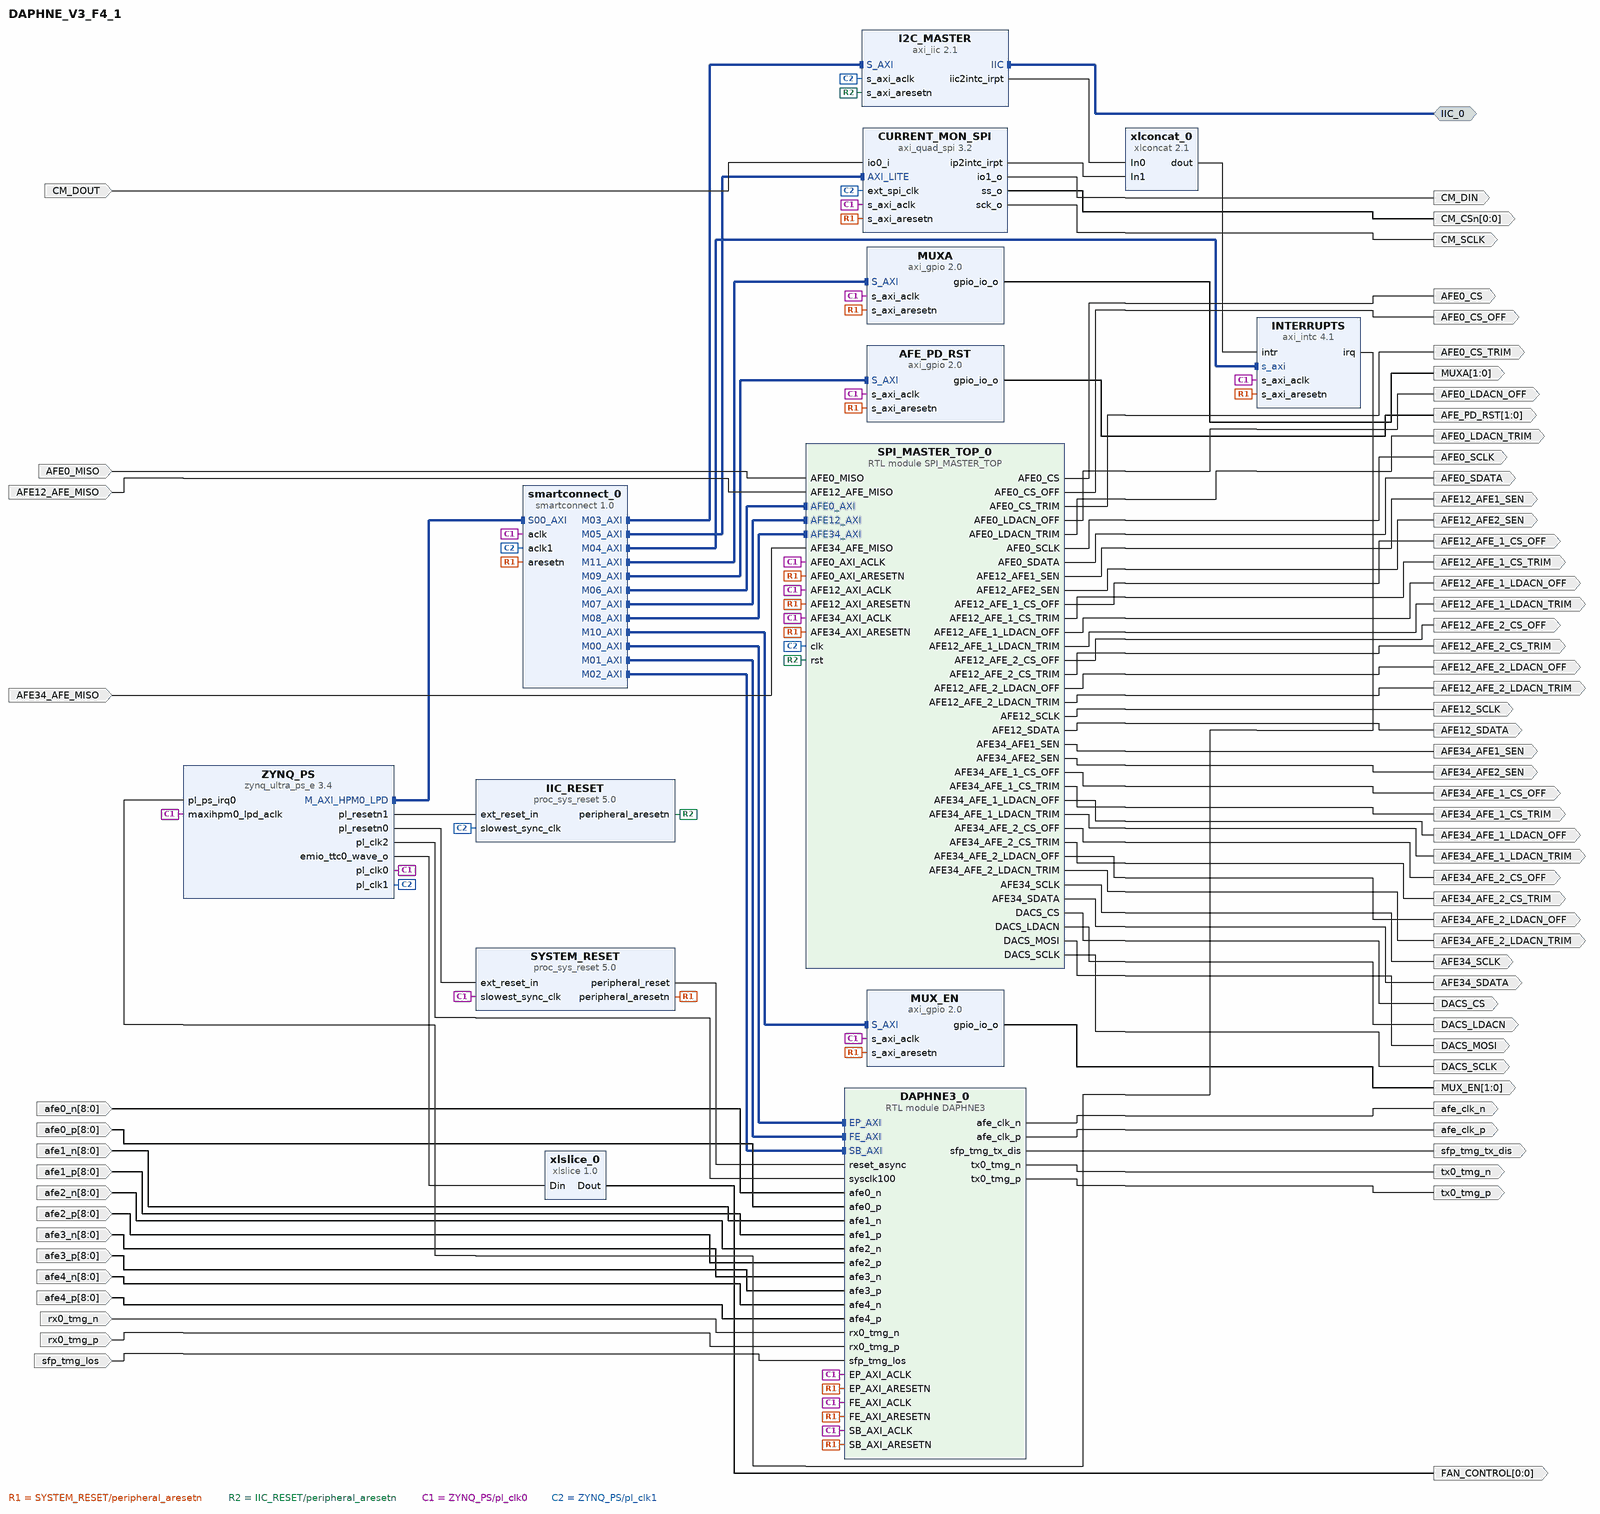
[diagram p0: block diagram of the top level]
# Vivado block design DAPHNE_V3_F4_1, xck26-sfvc784-2LV-c, Vivado 2022.2.2
create_bd_design DAPHNE_V3_F4_1

create_bd_intf_port -mode Master -vlnv xilinx.com:interface:iic_rtl:1.0 IIC_0
create_bd_port -dir O tx0_tmg_n
create_bd_port -dir I rx0_tmg_n
create_bd_port -dir I sfp_tmg_los
create_bd_port -dir I rx0_tmg_p
create_bd_port -dir O sfp_tmg_tx_dis
create_bd_port -dir O -type clk afe_clk_p
create_bd_port -dir I -from 8 -to 0 afe4_p
create_bd_port -dir I -from 8 -to 0 afe4_n
create_bd_port -dir I -from 8 -to 0 afe3_p
create_bd_port -dir I -from 8 -to 0 afe3_n
create_bd_port -dir I -from 8 -to 0 afe1_p
create_bd_port -dir I -from 8 -to 0 afe1_n
create_bd_port -dir I -from 8 -to 0 afe2_p
create_bd_port -dir I -from 8 -to 0 afe2_n
create_bd_port -dir I -from 8 -to 0 afe0_p
create_bd_port -dir I -from 8 -to 0 afe0_n
create_bd_port -dir O tx0_tmg_p
create_bd_port -dir O -type clk afe_clk_n
create_bd_port -dir I AFE0_MISO
create_bd_port -dir I AFE12_AFE_MISO
create_bd_port -dir I AFE34_AFE_MISO
create_bd_port -dir O AFE12_AFE_1_LDACN_OFF
create_bd_port -dir O AFE12_AFE_1_CS_OFF
create_bd_port -dir O AFE0_SCLK
create_bd_port -dir O AFE12_AFE1_SEN
create_bd_port -dir O AFE12_AFE_2_LDACN_OFF
create_bd_port -dir O AFE0_CS_TRIM
create_bd_port -dir O AFE0_CS
create_bd_port -dir O AFE0_SDATA
create_bd_port -dir O AFE34_AFE_1_LDACN_TRIM
create_bd_port -dir O AFE0_CS_OFF
create_bd_port -dir O AFE12_SDATA
create_bd_port -dir O AFE34_AFE_2_CS_OFF
create_bd_port -dir O AFE12_AFE_2_CS_OFF
create_bd_port -dir O AFE34_AFE2_SEN
create_bd_port -dir O AFE12_AFE_1_LDACN_TRIM
create_bd_port -dir O AFE34_AFE_2_CS_TRIM
create_bd_port -dir O AFE34_SCLK
create_bd_port -dir O AFE12_SCLK
create_bd_port -dir O AFE34_AFE1_SEN
create_bd_port -dir O AFE34_AFE_1_CS_OFF
create_bd_port -dir O AFE12_AFE_1_CS_TRIM
create_bd_port -dir O AFE34_SDATA
create_bd_port -dir O AFE12_AFE2_SEN
create_bd_port -dir O AFE0_LDACN_OFF
create_bd_port -dir O AFE34_AFE_1_CS_TRIM
create_bd_port -dir O AFE0_LDACN_TRIM
create_bd_port -dir O AFE12_AFE_2_CS_TRIM
create_bd_port -dir O AFE12_AFE_2_LDACN_TRIM
create_bd_port -dir O AFE34_AFE_1_LDACN_OFF
create_bd_port -dir O AFE34_AFE_2_LDACN_TRIM
create_bd_port -dir O AFE34_AFE_2_LDACN_OFF
create_bd_port -dir O -from 0 -to 0 FAN_CONTROL
create_bd_port -dir O DACS_CS
create_bd_port -dir O DACS_SCLK
create_bd_port -dir O DACS_MOSI
create_bd_port -dir O DACS_LDACN
create_bd_port -dir O -from 0 -to 0 CM_CSn
create_bd_port -dir O CM_SCLK
create_bd_port -dir I CM_DOUT
create_bd_port -dir O CM_DIN
create_bd_port -dir O -from 1 -to 0 AFE_PD_RST
create_bd_port -dir O -from 1 -to 0 MUX_EN
create_bd_port -dir O -from 1 -to 0 MUXA

create_bd_cell -type ip -vlnv xilinx.com:ip:zynq_ultra_ps_e:3.4 ZYNQ_PS
set_property -dict [list \
  CONFIG.CAN0_BOARD_INTERFACE custom \
  CONFIG.CAN1_BOARD_INTERFACE custom \
  CONFIG.CSU_BOARD_INTERFACE custom \
  CONFIG.DP_BOARD_INTERFACE custom \
  CONFIG.GEM0_BOARD_INTERFACE custom \
  CONFIG.GEM1_BOARD_INTERFACE custom \
  CONFIG.GEM2_BOARD_INTERFACE custom \
  CONFIG.GEM3_BOARD_INTERFACE custom \
  CONFIG.GPIO_BOARD_INTERFACE custom \
  CONFIG.IIC0_BOARD_INTERFACE custom \
  CONFIG.IIC1_BOARD_INTERFACE custom \
  CONFIG.NAND_BOARD_INTERFACE custom \
  CONFIG.PCIE_BOARD_INTERFACE custom \
  CONFIG.PJTAG_BOARD_INTERFACE custom \
  CONFIG.PMU_BOARD_INTERFACE custom \
  CONFIG.PSU_BANK_0_IO_STANDARD LVCMOS18 \
  CONFIG.PSU_BANK_1_IO_STANDARD LVCMOS18 \
  CONFIG.PSU_BANK_2_IO_STANDARD LVCMOS18 \
  CONFIG.PSU_BANK_3_IO_STANDARD LVCMOS18 \
  CONFIG.PSU_USB3__DUAL_CLOCK_ENABLE 1 \
  CONFIG.PSU__CAN1__PERIPHERAL__ENABLE 0 \
  CONFIG.PSU__CRF_APB__ACPU_CTRL__FREQMHZ 1333.333 \
  CONFIG.PSU__CRF_APB__ACPU_CTRL__SRCSEL APLL \
  CONFIG.PSU__CRF_APB__APLL_CTRL__SRCSEL PSS_REF_CLK \
  CONFIG.PSU__CRF_APB__APLL_FRAC_CFG__ENABLED 1 \
  CONFIG.PSU__CRF_APB__DBG_FPD_CTRL__FREQMHZ 250 \
  CONFIG.PSU__CRF_APB__DBG_FPD_CTRL__SRCSEL IOPLL \
  CONFIG.PSU__CRF_APB__DBG_TRACE_CTRL__FREQMHZ 250 \
  CONFIG.PSU__CRF_APB__DBG_TRACE_CTRL__SRCSEL IOPLL \
  CONFIG.PSU__CRF_APB__DBG_TSTMP_CTRL__FREQMHZ 250 \
  CONFIG.PSU__CRF_APB__DBG_TSTMP_CTRL__SRCSEL IOPLL \
  CONFIG.PSU__CRF_APB__DDR_CTRL__FREQMHZ 1200 \
  CONFIG.PSU__CRF_APB__DDR_CTRL__SRCSEL DPLL \
  CONFIG.PSU__CRF_APB__DPDMA_REF_CTRL__FREQMHZ 600 \
  CONFIG.PSU__CRF_APB__DPDMA_REF_CTRL__SRCSEL APLL \
  CONFIG.PSU__CRF_APB__DPLL_CTRL__SRCSEL PSS_REF_CLK \
  CONFIG.PSU__CRF_APB__DP_AUDIO_REF_CTRL__SRCSEL RPLL \
  CONFIG.PSU__CRF_APB__DP_STC_REF_CTRL__SRCSEL RPLL \
  CONFIG.PSU__CRF_APB__DP_VIDEO_REF_CTRL__SRCSEL VPLL \
  CONFIG.PSU__CRF_APB__GDMA_REF_CTRL__FREQMHZ 600 \
  CONFIG.PSU__CRF_APB__GDMA_REF_CTRL__SRCSEL DPLL \
  CONFIG.PSU__CRF_APB__GPU_REF_CTRL__FREQMHZ 600 \
  CONFIG.PSU__CRF_APB__GPU_REF_CTRL__SRCSEL IOPLL \
  CONFIG.PSU__CRF_APB__TOPSW_LSBUS_CTRL__FREQMHZ 100 \
  CONFIG.PSU__CRF_APB__TOPSW_LSBUS_CTRL__SRCSEL IOPLL \
  CONFIG.PSU__CRF_APB__TOPSW_MAIN_CTRL__FREQMHZ 533.33 \
  CONFIG.PSU__CRF_APB__TOPSW_MAIN_CTRL__SRCSEL DPLL \
  CONFIG.PSU__CRF_APB__VPLL_CTRL__SRCSEL PSS_REF_CLK \
  CONFIG.PSU__CRL_APB__ADMA_REF_CTRL__FREQMHZ 500 \
  CONFIG.PSU__CRL_APB__ADMA_REF_CTRL__SRCSEL IOPLL \
  CONFIG.PSU__CRL_APB__CAN1_REF_CTRL__FREQMHZ 100 \
  CONFIG.PSU__CRL_APB__CAN1_REF_CTRL__SRCSEL IOPLL \
  CONFIG.PSU__CRL_APB__CPU_R5_CTRL__FREQMHZ 533.333 \
  CONFIG.PSU__CRL_APB__CPU_R5_CTRL__SRCSEL RPLL \
  CONFIG.PSU__CRL_APB__DBG_LPD_CTRL__FREQMHZ 250 \
  CONFIG.PSU__CRL_APB__DBG_LPD_CTRL__SRCSEL IOPLL \
  CONFIG.PSU__CRL_APB__GEM3_REF_CTRL__FREQMHZ 125 \
  CONFIG.PSU__CRL_APB__GEM3_REF_CTRL__SRCSEL IOPLL \
  CONFIG.PSU__CRL_APB__I2C0_REF_CTRL__FREQMHZ 100 \
  CONFIG.PSU__CRL_APB__I2C0_REF_CTRL__SRCSEL IOPLL \
  CONFIG.PSU__CRL_APB__I2C1_REF_CTRL__FREQMHZ 100 \
  CONFIG.PSU__CRL_APB__I2C1_REF_CTRL__SRCSEL IOPLL \
  CONFIG.PSU__CRL_APB__IOPLL_CTRL__SRCSEL PSS_REF_CLK \
  CONFIG.PSU__CRL_APB__IOU_SWITCH_CTRL__FREQMHZ 250 \
  CONFIG.PSU__CRL_APB__IOU_SWITCH_CTRL__SRCSEL IOPLL \
  CONFIG.PSU__CRL_APB__LPD_LSBUS_CTRL__FREQMHZ 100 \
  CONFIG.PSU__CRL_APB__LPD_LSBUS_CTRL__SRCSEL IOPLL \
  CONFIG.PSU__CRL_APB__LPD_SWITCH_CTRL__FREQMHZ 500 \
  CONFIG.PSU__CRL_APB__LPD_SWITCH_CTRL__SRCSEL IOPLL \
  CONFIG.PSU__CRL_APB__PCAP_CTRL__FREQMHZ 200 \
  CONFIG.PSU__CRL_APB__PCAP_CTRL__SRCSEL IOPLL \
  CONFIG.PSU__CRL_APB__PL0_REF_CTRL__FREQMHZ 125 \
  CONFIG.PSU__CRL_APB__PL0_REF_CTRL__SRCSEL IOPLL \
  CONFIG.PSU__CRL_APB__PL1_REF_CTRL__FREQMHZ 25 \
  CONFIG.PSU__CRL_APB__PL1_REF_CTRL__SRCSEL IOPLL \
  CONFIG.PSU__CRL_APB__PL2_REF_CTRL__SRCSEL IOPLL \
  CONFIG.PSU__CRL_APB__QSPI_REF_CTRL__FREQMHZ 125 \
  CONFIG.PSU__CRL_APB__QSPI_REF_CTRL__SRCSEL IOPLL \
  CONFIG.PSU__CRL_APB__RPLL_CTRL__SRCSEL PSS_REF_CLK \
  CONFIG.PSU__CRL_APB__SDIO0_REF_CTRL__SRCSEL IOPLL \
  CONFIG.PSU__CRL_APB__SDIO1_REF_CTRL__FREQMHZ 200 \
  CONFIG.PSU__CRL_APB__SDIO1_REF_CTRL__SRCSEL IOPLL \
  CONFIG.PSU__CRL_APB__SPI1_REF_CTRL__SRCSEL IOPLL \
  CONFIG.PSU__CRL_APB__TIMESTAMP_REF_CTRL__FREQMHZ 100 \
  CONFIG.PSU__CRL_APB__TIMESTAMP_REF_CTRL__SRCSEL IOPLL \
  CONFIG.PSU__CRL_APB__UART0_REF_CTRL__FREQMHZ 100 \
  CONFIG.PSU__CRL_APB__UART0_REF_CTRL__SRCSEL IOPLL \
  CONFIG.PSU__CRL_APB__UART1_REF_CTRL__FREQMHZ 100 \
  CONFIG.PSU__CRL_APB__UART1_REF_CTRL__SRCSEL IOPLL \
  CONFIG.PSU__CRL_APB__USB0_BUS_REF_CTRL__FREQMHZ 250 \
  CONFIG.PSU__CRL_APB__USB0_BUS_REF_CTRL__SRCSEL IOPLL \
  CONFIG.PSU__CRL_APB__USB3_DUAL_REF_CTRL__FREQMHZ 20 \
  CONFIG.PSU__CRL_APB__USB3_DUAL_REF_CTRL__SRCSEL IOPLL \
  CONFIG.PSU__CRL_APB__USB3__ENABLE 1 \
  CONFIG.PSU__CSUPMU__PERIPHERAL__VALID 1 \
  CONFIG.PSU__DDRC__BUS_WIDTH {64 Bit} \
  CONFIG.PSU__DDRC__COMPONENTS Components \
  CONFIG.PSU__DDRC__DEVICE_CAPACITY {8192 MBits} \
  CONFIG.PSU__DDRC__DRAM_WIDTH {16 Bits} \
  CONFIG.PSU__DDRC__ECC Disabled \
  CONFIG.PSU__DDRC__MEMORY_TYPE {DDR 4} \
  CONFIG.PSU__DDRC__SPEED_BIN DDR4_2400R \
  CONFIG.PSU__DDR_HIGH_ADDRESS_GUI_ENABLE 1 \
  CONFIG.PSU__DDR__INTERFACE__FREQMHZ 600.000 \
  CONFIG.PSU__DEVICE_TYPE EV \
  CONFIG.PSU__DISPLAYPORT__LANE0__ENABLE 0 \
  CONFIG.PSU__DISPLAYPORT__LANE1__ENABLE 0 \
  CONFIG.PSU__DISPLAYPORT__PERIPHERAL__ENABLE 1 \
  CONFIG.PSU__DLL__ISUSED 1 \
  CONFIG.PSU__DPAUX__PERIPHERAL__ENABLE 1 \
  CONFIG.PSU__DPAUX__PERIPHERAL__IO {MIO 27 .. 30} \
  CONFIG.PSU__DP__LANE_SEL None \
  CONFIG.PSU__ENET0__PERIPHERAL__ENABLE 1 \
  CONFIG.PSU__ENET0__PERIPHERAL__IO {GT Lane0} \
  CONFIG.PSU__ENET1__GRP_MDIO__ENABLE 1 \
  CONFIG.PSU__ENET1__GRP_MDIO__IO {MIO 50 .. 51} \
  CONFIG.PSU__ENET1__PERIPHERAL__ENABLE 1 \
  CONFIG.PSU__ENET1__PERIPHERAL__IO {MIO 38 .. 49} \
  CONFIG.PSU__ENET3__PERIPHERAL__ENABLE 0 \
  CONFIG.PSU__FPGA_PL0_ENABLE 1 \
  CONFIG.PSU__FPGA_PL1_ENABLE 1 \
  CONFIG.PSU__FPGA_PL2_ENABLE 1 \
  CONFIG.PSU__GEM0__REF_CLK_FREQ 125 \
  CONFIG.PSU__GEM0__REF_CLK_SEL {Ref Clk1} \
  CONFIG.PSU__GEM__TSU__ENABLE 0 \
  CONFIG.PSU__GPIO0_MIO__IO {MIO 0 .. 25} \
  CONFIG.PSU__GPIO0_MIO__PERIPHERAL__ENABLE 1 \
  CONFIG.PSU__GPIO1_MIO__PERIPHERAL__ENABLE 0 \
  CONFIG.PSU__GPIO2_MIO__IO {MIO 52 .. 77} \
  CONFIG.PSU__GPIO2_MIO__PERIPHERAL__ENABLE 1 \
  CONFIG.PSU__GPIO_EMIO__WIDTH {[93:0]} \
  CONFIG.PSU__GT__LINK_SPEED HBR \
  CONFIG.PSU__GT__PRE_EMPH_LVL_4 0 \
  CONFIG.PSU__GT__VLT_SWNG_LVL_4 0 \
  CONFIG.PSU__I2C0__PERIPHERAL__ENABLE 0 \
  CONFIG.PSU__I2C1__PERIPHERAL__ENABLE 1 \
  CONFIG.PSU__I2C1__PERIPHERAL__IO {MIO 24 .. 25} \
  CONFIG.PSU__IOU_SLCR__IOU_TTC_APB_CLK__TTC0_SEL APB \
  CONFIG.PSU__IOU_SLCR__IOU_TTC_APB_CLK__TTC1_SEL APB \
  CONFIG.PSU__IOU_SLCR__IOU_TTC_APB_CLK__TTC2_SEL APB \
  CONFIG.PSU__IOU_SLCR__IOU_TTC_APB_CLK__TTC3_SEL APB \
  CONFIG.PSU__NUM_FABRIC_RESETS 2 \
  CONFIG.PSU__OVERRIDE_HPX_QOS 0 \
  CONFIG.PSU__OVERRIDE__BASIC_CLOCK 0 \
  CONFIG.PSU__PMU_COHERENCY 0 \
  CONFIG.PSU__PMU__AIBACK__ENABLE 0 \
  CONFIG.PSU__PMU__EMIO_GPI__ENABLE 0 \
  CONFIG.PSU__PMU__EMIO_GPO__ENABLE 0 \
  CONFIG.PSU__PMU__GPI0__ENABLE 1 \
  CONFIG.PSU__PMU__GPI0__IO {MIO 26} \
  CONFIG.PSU__PMU__GPI1__ENABLE 0 \
  CONFIG.PSU__PMU__GPI2__ENABLE 0 \
  CONFIG.PSU__PMU__GPI3__ENABLE 0 \
  CONFIG.PSU__PMU__GPI4__ENABLE 0 \
  CONFIG.PSU__PMU__GPI5__ENABLE 1 \
  CONFIG.PSU__PMU__GPI5__IO {MIO 31} \
  CONFIG.PSU__PMU__GPO0__ENABLE 0 \
  CONFIG.PSU__PMU__GPO1__ENABLE 0 \
  CONFIG.PSU__PMU__GPO2__ENABLE 0 \
  CONFIG.PSU__PMU__GPO3__ENABLE 1 \
  CONFIG.PSU__PMU__GPO3__IO {MIO 35} \
  CONFIG.PSU__PMU__GPO3__POLARITY low \
  CONFIG.PSU__PMU__GPO4__ENABLE 0 \
  CONFIG.PSU__PMU__GPO5__ENABLE 0 \
  CONFIG.PSU__PMU__PERIPHERAL__ENABLE 1 \
  CONFIG.PSU__PMU__PLERROR__ENABLE 0 \
  CONFIG.PSU__PRESET_APPLIED 1 \
  CONFIG.PSU__PSS_REF_CLK__FREQMHZ 33.333 \
  CONFIG.PSU__QSPI_COHERENCY 0 \
  CONFIG.PSU__QSPI_ROUTE_THROUGH_FPD 0 \
  CONFIG.PSU__QSPI__GRP_FBCLK__ENABLE 0 \
  CONFIG.PSU__QSPI__PERIPHERAL__DATA_MODE x4 \
  CONFIG.PSU__QSPI__PERIPHERAL__ENABLE 1 \
  CONFIG.PSU__QSPI__PERIPHERAL__IO {MIO 0 .. 5} \
  CONFIG.PSU__QSPI__PERIPHERAL__MODE Single \
  CONFIG.PSU__SATA__PERIPHERAL__ENABLE 0 \
  CONFIG.PSU__SD0__CLK_200_SDR_OTAP_DLY 0x3 \
  CONFIG.PSU__SD0__CLK_50_DDR_ITAP_DLY 0x12 \
  CONFIG.PSU__SD0__CLK_50_DDR_OTAP_DLY 0x6 \
  CONFIG.PSU__SD0__CLK_50_SDR_ITAP_DLY 0x15 \
  CONFIG.PSU__SD0__CLK_50_SDR_OTAP_DLY 0x6 \
  CONFIG.PSU__SD0__DATA_TRANSFER_MODE 8Bit \
  CONFIG.PSU__SD0__GRP_POW__ENABLE 1 \
  CONFIG.PSU__SD0__GRP_POW__IO {MIO 23} \
  CONFIG.PSU__SD0__PERIPHERAL__ENABLE 1 \
  CONFIG.PSU__SD0__PERIPHERAL__IO {MIO 13 .. 22} \
  CONFIG.PSU__SD0__RESET__ENABLE 1 \
  CONFIG.PSU__SD0__SLOT_TYPE eMMC \
  CONFIG.PSU__SD1__CLK_100_SDR_OTAP_DLY 0x3 \
  CONFIG.PSU__SD1__CLK_200_SDR_OTAP_DLY 0x3 \
  CONFIG.PSU__SD1__CLK_50_DDR_ITAP_DLY 0x3D \
  CONFIG.PSU__SD1__CLK_50_DDR_OTAP_DLY 0x4 \
  CONFIG.PSU__SD1__CLK_50_SDR_ITAP_DLY 0x15 \
  CONFIG.PSU__SD1__CLK_50_SDR_OTAP_DLY 0x5 \
  CONFIG.PSU__SD1__PERIPHERAL__ENABLE 0 \
  CONFIG.PSU__SPI1__GRP_SS0__IO {MIO 9} \
  CONFIG.PSU__SPI1__PERIPHERAL__ENABLE 1 \
  CONFIG.PSU__SPI1__PERIPHERAL__IO {MIO 6 .. 11} \
  CONFIG.PSU__SWDT0__CLOCK__ENABLE 0 \
  CONFIG.PSU__SWDT0__PERIPHERAL__ENABLE 1 \
  CONFIG.PSU__SWDT0__RESET__ENABLE 0 \
  CONFIG.PSU__SWDT1__CLOCK__ENABLE 0 \
  CONFIG.PSU__SWDT1__PERIPHERAL__ENABLE 1 \
  CONFIG.PSU__SWDT1__RESET__ENABLE 0 \
  CONFIG.PSU__TSU__BUFG_PORT_PAIR 0 \
  CONFIG.PSU__TTC0__CLOCK__ENABLE 0 \
  CONFIG.PSU__TTC0__PERIPHERAL__ENABLE 1 \
  CONFIG.PSU__TTC0__WAVEOUT__ENABLE 1 \
  CONFIG.PSU__TTC0__WAVEOUT__IO EMIO \
  CONFIG.PSU__TTC1__CLOCK__ENABLE 0 \
  CONFIG.PSU__TTC1__PERIPHERAL__ENABLE 1 \
  CONFIG.PSU__TTC1__WAVEOUT__ENABLE 0 \
  CONFIG.PSU__TTC2__CLOCK__ENABLE 0 \
  CONFIG.PSU__TTC2__PERIPHERAL__ENABLE 1 \
  CONFIG.PSU__TTC2__WAVEOUT__ENABLE 0 \
  CONFIG.PSU__TTC3__CLOCK__ENABLE 0 \
  CONFIG.PSU__TTC3__PERIPHERAL__ENABLE 1 \
  CONFIG.PSU__TTC3__WAVEOUT__ENABLE 0 \
  CONFIG.PSU__UART0__PERIPHERAL__ENABLE 0 \
  CONFIG.PSU__UART1__BAUD_RATE 115200 \
  CONFIG.PSU__UART1__MODEM__ENABLE 1 \
  CONFIG.PSU__UART1__PERIPHERAL__ENABLE 1 \
  CONFIG.PSU__UART1__PERIPHERAL__IO {MIO 36 .. 37} \
  CONFIG.PSU__USB0_COHERENCY 0 \
  CONFIG.PSU__USB0__PERIPHERAL__ENABLE 1 \
  CONFIG.PSU__USB0__PERIPHERAL__IO {MIO 52 .. 63} \
  CONFIG.PSU__USB0__REF_CLK_FREQ 26 \
  CONFIG.PSU__USB0__REF_CLK_SEL {Ref Clk3} \
  CONFIG.PSU__USB0__RESET__ENABLE 1 \
  CONFIG.PSU__USB0__RESET__IO {MIO 7} \
  CONFIG.PSU__USB1__PERIPHERAL__ENABLE 1 \
  CONFIG.PSU__USB1__PERIPHERAL__IO {MIO 64 .. 75} \
  CONFIG.PSU__USB1__REF_CLK_FREQ 26 \
  CONFIG.PSU__USB1__REF_CLK_SEL {Ref Clk3} \
  CONFIG.PSU__USB1__RESET__ENABLE 1 \
  CONFIG.PSU__USB1__RESET__IO {MIO 8} \
  CONFIG.PSU__USB2_0__EMIO__ENABLE 0 \
  CONFIG.PSU__USB3_0__EMIO__ENABLE 0 \
  CONFIG.PSU__USB3_0__PERIPHERAL__ENABLE 1 \
  CONFIG.PSU__USB3_0__PERIPHERAL__IO {GT Lane1} \
  CONFIG.PSU__USB3_1__PERIPHERAL__ENABLE 1 \
  CONFIG.PSU__USB3_1__PERIPHERAL__IO {GT Lane3} \
  CONFIG.PSU__USB__RESET__MODE {Separate MIO Pin} \
  CONFIG.PSU__USB__RESET__POLARITY {Active Low} \
  CONFIG.PSU__USE__IRQ0 1 \
  CONFIG.PSU__USE__M_AXI_GP0 0 \
  CONFIG.PSU__USE__M_AXI_GP1 0 \
  CONFIG.PSU__USE__M_AXI_GP2 1 \
  CONFIG.QSPI_BOARD_INTERFACE custom \
  CONFIG.SATA_BOARD_INTERFACE custom \
  CONFIG.SD0_BOARD_INTERFACE custom \
  CONFIG.SD1_BOARD_INTERFACE custom \
  CONFIG.SPI0_BOARD_INTERFACE custom \
  CONFIG.SPI1_BOARD_INTERFACE custom \
  CONFIG.SUBPRESET1 Custom \
  CONFIG.SUBPRESET2 Custom \
  CONFIG.SWDT0_BOARD_INTERFACE custom \
  CONFIG.SWDT1_BOARD_INTERFACE custom \
  CONFIG.TRACE_BOARD_INTERFACE custom \
  CONFIG.TTC0_BOARD_INTERFACE custom \
  CONFIG.TTC1_BOARD_INTERFACE custom \
  CONFIG.TTC2_BOARD_INTERFACE custom \
  CONFIG.TTC3_BOARD_INTERFACE custom \
  CONFIG.UART0_BOARD_INTERFACE custom \
  CONFIG.UART1_BOARD_INTERFACE custom \
  CONFIG.USB0_BOARD_INTERFACE custom \
  CONFIG.USB1_BOARD_INTERFACE custom \
  CONFIG.preset None \
] [get_bd_cells ZYNQ_PS]
# 731 more settings of ZYNQ_PS are not shown: defaults, MIO pin electricals, DDR timing, and values the tool derives
create_bd_cell -type ip -vlnv xilinx.com:ip:smartconnect:1.0 smartconnect_0
set_property -dict {CONFIG.NUM_CLKS 2 CONFIG.NUM_MI 12 CONFIG.NUM_SI 1} [get_bd_cells smartconnect_0]
create_bd_cell -type ip -vlnv xilinx.com:ip:proc_sys_reset:5.0 SYSTEM_RESET
create_bd_cell -type ip -vlnv xilinx.com:ip:proc_sys_reset:5.0 IIC_RESET
create_bd_cell -type ip -vlnv xilinx.com:ip:axi_iic:2.1 I2C_MASTER
create_bd_cell -type ip -vlnv xilinx.com:ip:xlconcat:2.1 xlconcat_0
create_bd_cell -type ip -vlnv xilinx.com:ip:axi_intc:4.1 INTERRUPTS
set_property -dict {CONFIG.C_IRQ_CONNECTION 1} [get_bd_cells INTERRUPTS]
create_bd_cell -type ip -vlnv xilinx.com:ip:axi_quad_spi:3.2 CURRENT_MON_SPI
create_bd_cell -type ip -vlnv xilinx.com:ip:xlslice:1.0 xlslice_0
set_property -dict {CONFIG.DIN_WIDTH 3 CONFIG.DOUT_WIDTH 1} [get_bd_cells xlslice_0]
create_bd_cell -type module -reference SPI_MASTER_TOP SPI_MASTER_TOP_0
create_bd_cell -type ip -vlnv xilinx.com:ip:axi_gpio:2.0 AFE_PD_RST
set_property -dict {CONFIG.C_ALL_OUTPUTS 1 CONFIG.C_GPIO_WIDTH 2} [get_bd_cells AFE_PD_RST]
create_bd_cell -type ip -vlnv xilinx.com:ip:axi_gpio:2.0 MUX_EN
set_property -dict {CONFIG.C_ALL_OUTPUTS 1 CONFIG.C_GPIO_WIDTH 2} [get_bd_cells MUX_EN]
create_bd_cell -type ip -vlnv xilinx.com:ip:axi_gpio:2.0 MUXA
set_property -dict {CONFIG.C_ALL_OUTPUTS 1 CONFIG.C_GPIO_WIDTH 2} [get_bd_cells MUXA]
create_bd_cell -type module -reference DAPHNE3 DAPHNE3_0

# ---- connections ----

connect_bd_intf_net -intf_net axi_iic_0_IIC [get_bd_intf_ports IIC_0] [get_bd_intf_pins I2C_MASTER/IIC]
connect_bd_intf_net [get_bd_intf_pins DAPHNE3_0/EP_AXI] [get_bd_intf_pins smartconnect_0/M00_AXI]
connect_bd_intf_net [get_bd_intf_pins DAPHNE3_0/FE_AXI] [get_bd_intf_pins smartconnect_0/M01_AXI]
connect_bd_intf_net [get_bd_intf_pins DAPHNE3_0/SB_AXI] [get_bd_intf_pins smartconnect_0/M02_AXI]
connect_bd_intf_net [get_bd_intf_pins I2C_MASTER/S_AXI] [get_bd_intf_pins smartconnect_0/M03_AXI]
connect_bd_intf_net [get_bd_intf_pins INTERRUPTS/s_axi] [get_bd_intf_pins smartconnect_0/M04_AXI]
connect_bd_intf_net [get_bd_intf_pins CURRENT_MON_SPI/AXI_LITE] [get_bd_intf_pins smartconnect_0/M05_AXI]
connect_bd_intf_net [get_bd_intf_pins SPI_MASTER_TOP_0/AFE0_AXI] [get_bd_intf_pins smartconnect_0/M06_AXI]
connect_bd_intf_net [get_bd_intf_pins SPI_MASTER_TOP_0/AFE12_AXI] [get_bd_intf_pins smartconnect_0/M07_AXI]
connect_bd_intf_net [get_bd_intf_pins SPI_MASTER_TOP_0/AFE34_AXI] [get_bd_intf_pins smartconnect_0/M08_AXI]
connect_bd_intf_net [get_bd_intf_pins AFE_PD_RST/S_AXI] [get_bd_intf_pins smartconnect_0/M09_AXI]
connect_bd_intf_net [get_bd_intf_pins MUX_EN/S_AXI] [get_bd_intf_pins smartconnect_0/M10_AXI]
connect_bd_intf_net [get_bd_intf_pins MUXA/S_AXI] [get_bd_intf_pins smartconnect_0/M11_AXI]
connect_bd_intf_net -intf_net zynq_ultra_ps_e_0_M_AXI_HPM0_LPD [get_bd_intf_pins smartconnect_0/S00_AXI] [get_bd_intf_pins ZYNQ_PS/M_AXI_HPM0_LPD]
connect_bd_net -net AFE0_MISO_0_1 [get_bd_ports AFE0_MISO] [get_bd_pins SPI_MASTER_TOP_0/AFE0_MISO]
connect_bd_net -net AFE12_AFE_MISO_0_1 [get_bd_ports AFE12_AFE_MISO] [get_bd_pins SPI_MASTER_TOP_0/AFE12_AFE_MISO]
connect_bd_net -net AFE34_AFE_MISO_0_1 [get_bd_ports AFE34_AFE_MISO] [get_bd_pins SPI_MASTER_TOP_0/AFE34_AFE_MISO]
connect_bd_net [get_bd_pins AFE_PD_RST/gpio_io_o] [get_bd_ports AFE_PD_RST]
connect_bd_net [get_bd_pins CURRENT_MON_SPI/io1_o] [get_bd_ports CM_DIN]
connect_bd_net [get_bd_pins CURRENT_MON_SPI/sck_o] [get_bd_ports CM_SCLK]
connect_bd_net [get_bd_pins CURRENT_MON_SPI/ss_o] [get_bd_ports CM_CSn]
connect_bd_net [get_bd_pins DAPHNE3_0/afe_clk_n] [get_bd_ports afe_clk_n]
connect_bd_net [get_bd_pins DAPHNE3_0/afe_clk_p] [get_bd_ports afe_clk_p]
connect_bd_net [get_bd_pins DAPHNE3_0/sfp_tmg_tx_dis] [get_bd_ports sfp_tmg_tx_dis]
connect_bd_net [get_bd_pins DAPHNE3_0/tx0_tmg_n] [get_bd_ports tx0_tmg_n]
connect_bd_net [get_bd_pins DAPHNE3_0/tx0_tmg_p] [get_bd_ports tx0_tmg_p]
connect_bd_net [get_bd_pins MUXA/gpio_io_o] [get_bd_ports MUXA]
connect_bd_net [get_bd_pins SPI_MASTER_TOP_0/AFE0_CS] [get_bd_ports AFE0_CS]
connect_bd_net [get_bd_pins SPI_MASTER_TOP_0/AFE0_CS_OFF] [get_bd_ports AFE0_CS_OFF]
connect_bd_net [get_bd_pins SPI_MASTER_TOP_0/AFE0_CS_TRIM] [get_bd_ports AFE0_CS_TRIM]
connect_bd_net [get_bd_pins SPI_MASTER_TOP_0/AFE0_LDACN_OFF] [get_bd_ports AFE0_LDACN_OFF]
connect_bd_net [get_bd_pins SPI_MASTER_TOP_0/AFE0_LDACN_TRIM] [get_bd_ports AFE0_LDACN_TRIM]
connect_bd_net [get_bd_pins SPI_MASTER_TOP_0/AFE0_SCLK] [get_bd_ports AFE0_SCLK]
connect_bd_net [get_bd_pins SPI_MASTER_TOP_0/AFE0_SDATA] [get_bd_ports AFE0_SDATA]
connect_bd_net [get_bd_pins SPI_MASTER_TOP_0/AFE12_AFE1_SEN] [get_bd_ports AFE12_AFE1_SEN]
connect_bd_net [get_bd_pins SPI_MASTER_TOP_0/AFE12_AFE2_SEN] [get_bd_ports AFE12_AFE2_SEN]
connect_bd_net [get_bd_pins SPI_MASTER_TOP_0/AFE12_AFE_1_CS_OFF] [get_bd_ports AFE12_AFE_1_CS_OFF]
connect_bd_net [get_bd_pins SPI_MASTER_TOP_0/AFE12_AFE_1_CS_TRIM] [get_bd_ports AFE12_AFE_1_CS_TRIM]
connect_bd_net [get_bd_pins SPI_MASTER_TOP_0/AFE12_AFE_1_LDACN_OFF] [get_bd_ports AFE12_AFE_1_LDACN_OFF]
connect_bd_net [get_bd_pins SPI_MASTER_TOP_0/AFE12_AFE_1_LDACN_TRIM] [get_bd_ports AFE12_AFE_1_LDACN_TRIM]
connect_bd_net [get_bd_pins SPI_MASTER_TOP_0/AFE12_AFE_2_CS_OFF] [get_bd_ports AFE12_AFE_2_CS_OFF]
connect_bd_net [get_bd_pins SPI_MASTER_TOP_0/AFE12_AFE_2_CS_TRIM] [get_bd_ports AFE12_AFE_2_CS_TRIM]
connect_bd_net [get_bd_pins SPI_MASTER_TOP_0/AFE12_AFE_2_LDACN_OFF] [get_bd_ports AFE12_AFE_2_LDACN_OFF]
connect_bd_net [get_bd_pins SPI_MASTER_TOP_0/AFE12_AFE_2_LDACN_TRIM] [get_bd_ports AFE12_AFE_2_LDACN_TRIM]
connect_bd_net [get_bd_pins SPI_MASTER_TOP_0/AFE12_SCLK] [get_bd_ports AFE12_SCLK]
connect_bd_net [get_bd_pins SPI_MASTER_TOP_0/AFE12_SDATA] [get_bd_ports AFE12_SDATA]
connect_bd_net [get_bd_pins SPI_MASTER_TOP_0/AFE34_AFE1_SEN] [get_bd_ports AFE34_AFE1_SEN]
connect_bd_net [get_bd_pins SPI_MASTER_TOP_0/AFE34_AFE2_SEN] [get_bd_ports AFE34_AFE2_SEN]
connect_bd_net [get_bd_pins SPI_MASTER_TOP_0/AFE34_AFE_1_CS_OFF] [get_bd_ports AFE34_AFE_1_CS_OFF]
connect_bd_net [get_bd_pins SPI_MASTER_TOP_0/AFE34_AFE_1_CS_TRIM] [get_bd_ports AFE34_AFE_1_CS_TRIM]
connect_bd_net [get_bd_pins SPI_MASTER_TOP_0/AFE34_AFE_1_LDACN_OFF] [get_bd_ports AFE34_AFE_1_LDACN_OFF]
connect_bd_net [get_bd_pins SPI_MASTER_TOP_0/AFE34_AFE_1_LDACN_TRIM] [get_bd_ports AFE34_AFE_1_LDACN_TRIM]
connect_bd_net [get_bd_pins SPI_MASTER_TOP_0/AFE34_AFE_2_CS_OFF] [get_bd_ports AFE34_AFE_2_CS_OFF]
connect_bd_net [get_bd_pins SPI_MASTER_TOP_0/AFE34_AFE_2_CS_TRIM] [get_bd_ports AFE34_AFE_2_CS_TRIM]
connect_bd_net [get_bd_pins SPI_MASTER_TOP_0/AFE34_AFE_2_LDACN_OFF] [get_bd_ports AFE34_AFE_2_LDACN_OFF]
connect_bd_net [get_bd_pins SPI_MASTER_TOP_0/AFE34_AFE_2_LDACN_TRIM] [get_bd_ports AFE34_AFE_2_LDACN_TRIM]
connect_bd_net [get_bd_pins SPI_MASTER_TOP_0/AFE34_SCLK] [get_bd_ports AFE34_SCLK]
connect_bd_net [get_bd_pins SPI_MASTER_TOP_0/AFE34_SDATA] [get_bd_ports AFE34_SDATA]
connect_bd_net [get_bd_pins SPI_MASTER_TOP_0/DACS_CS] [get_bd_ports DACS_CS]
connect_bd_net [get_bd_pins SPI_MASTER_TOP_0/DACS_LDACN] [get_bd_ports DACS_LDACN]
connect_bd_net [get_bd_pins SPI_MASTER_TOP_0/DACS_MOSI] [get_bd_ports DACS_MOSI]
connect_bd_net [get_bd_pins SPI_MASTER_TOP_0/DACS_SCLK] [get_bd_ports DACS_SCLK]
connect_bd_net [get_bd_pins SYSTEM_RESET/peripheral_reset] [get_bd_pins DAPHNE3_0/reset_async]
connect_bd_net [get_bd_pins ZYNQ_PS/emio_ttc0_wave_o] [get_bd_pins xlslice_0/Din]
connect_bd_net [get_bd_pins ZYNQ_PS/pl_clk2] [get_bd_pins DAPHNE3_0/sysclk100]
connect_bd_net -net afe0_n_0_1 [get_bd_ports afe0_n] [get_bd_pins DAPHNE3_0/afe0_n]
connect_bd_net -net afe0_p_0_1 [get_bd_ports afe0_p] [get_bd_pins DAPHNE3_0/afe0_p]
connect_bd_net -net afe1_n_0_1 [get_bd_ports afe1_n] [get_bd_pins DAPHNE3_0/afe1_n]
connect_bd_net -net afe1_p_0_1 [get_bd_ports afe1_p] [get_bd_pins DAPHNE3_0/afe1_p]
connect_bd_net -net afe2_n_0_1 [get_bd_ports afe2_n] [get_bd_pins DAPHNE3_0/afe2_n]
connect_bd_net -net afe2_p_0_1 [get_bd_ports afe2_p] [get_bd_pins DAPHNE3_0/afe2_p]
connect_bd_net -net afe3_n_0_1 [get_bd_ports afe3_n] [get_bd_pins DAPHNE3_0/afe3_n]
connect_bd_net -net afe3_p_0_1 [get_bd_ports afe3_p] [get_bd_pins DAPHNE3_0/afe3_p]
connect_bd_net -net afe4_n_0_1 [get_bd_ports afe4_n] [get_bd_pins DAPHNE3_0/afe4_n]
connect_bd_net -net afe4_p_0_1 [get_bd_ports afe4_p] [get_bd_pins DAPHNE3_0/afe4_p]
connect_bd_net -net axi_gpio_0_gpio_io_o [get_bd_pins MUX_EN/gpio_io_o] [get_bd_ports MUX_EN]
connect_bd_net -net axi_iic_0_iic2intc_irpt [get_bd_pins I2C_MASTER/iic2intc_irpt] [get_bd_pins xlconcat_0/In0]
connect_bd_net -net axi_intc_0_irq [get_bd_pins INTERRUPTS/irq] [get_bd_pins ZYNQ_PS/pl_ps_irq0]
connect_bd_net -net axi_quad_spi_0_ip2intc_irpt [get_bd_pins CURRENT_MON_SPI/ip2intc_irpt] [get_bd_pins xlconcat_0/In1]
connect_bd_net -net io0_i_0_1 [get_bd_ports CM_DOUT] [get_bd_pins CURRENT_MON_SPI/io0_i]
connect_bd_net -net proc_sys_reset_0_peripheral_aresetn [get_bd_pins SYSTEM_RESET/peripheral_aresetn] \
  [get_bd_pins smartconnect_0/aresetn] [get_bd_pins INTERRUPTS/s_axi_aresetn] [get_bd_pins CURRENT_MON_SPI/s_axi_aresetn] \
  [get_bd_pins SPI_MASTER_TOP_0/AFE0_AXI_ARESETN] [get_bd_pins SPI_MASTER_TOP_0/AFE12_AXI_ARESETN] \
  [get_bd_pins SPI_MASTER_TOP_0/AFE34_AXI_ARESETN] [get_bd_pins AFE_PD_RST/s_axi_aresetn] [get_bd_pins MUX_EN/s_axi_aresetn] \
  [get_bd_pins MUXA/s_axi_aresetn] [get_bd_pins DAPHNE3_0/SB_AXI_ARESETN] [get_bd_pins DAPHNE3_0/FE_AXI_ARESETN] \
  [get_bd_pins DAPHNE3_0/EP_AXI_ARESETN]
connect_bd_net -net proc_sys_reset_1_peripheral_aresetn [get_bd_pins IIC_RESET/peripheral_aresetn] \
  [get_bd_pins I2C_MASTER/s_axi_aresetn] [get_bd_pins SPI_MASTER_TOP_0/rst]
connect_bd_net -net rx0_tmg_n_0_1 [get_bd_ports rx0_tmg_n] [get_bd_pins DAPHNE3_0/rx0_tmg_n]
connect_bd_net -net rx0_tmg_p_0_1 [get_bd_ports rx0_tmg_p] [get_bd_pins DAPHNE3_0/rx0_tmg_p]
connect_bd_net -net sfp_tmg_los_0_1 [get_bd_ports sfp_tmg_los] [get_bd_pins DAPHNE3_0/sfp_tmg_los]
connect_bd_net [get_bd_pins xlconcat_0/dout] [get_bd_pins INTERRUPTS/intr]
connect_bd_net [get_bd_pins xlslice_0/Dout] [get_bd_ports FAN_CONTROL]
connect_bd_net -net zynq_ultra_ps_e_0_pl_clk0 [get_bd_pins ZYNQ_PS/pl_clk0] \
  [get_bd_pins smartconnect_0/aclk] [get_bd_pins SYSTEM_RESET/slowest_sync_clk] [get_bd_pins ZYNQ_PS/maxihpm0_lpd_aclk] \
  [get_bd_pins INTERRUPTS/s_axi_aclk] [get_bd_pins CURRENT_MON_SPI/s_axi_aclk] [get_bd_pins SPI_MASTER_TOP_0/AFE0_AXI_ACLK] \
  [get_bd_pins SPI_MASTER_TOP_0/AFE12_AXI_ACLK] [get_bd_pins SPI_MASTER_TOP_0/AFE34_AXI_ACLK] \
  [get_bd_pins AFE_PD_RST/s_axi_aclk] [get_bd_pins MUX_EN/s_axi_aclk] [get_bd_pins MUXA/s_axi_aclk] \
  [get_bd_pins DAPHNE3_0/SB_AXI_ACLK] [get_bd_pins DAPHNE3_0/FE_AXI_ACLK] [get_bd_pins DAPHNE3_0/EP_AXI_ACLK]
connect_bd_net -net zynq_ultra_ps_e_0_pl_clk1 [get_bd_pins ZYNQ_PS/pl_clk1] \
  [get_bd_pins smartconnect_0/aclk1] [get_bd_pins IIC_RESET/slowest_sync_clk] [get_bd_pins I2C_MASTER/s_axi_aclk] \
  [get_bd_pins CURRENT_MON_SPI/ext_spi_clk] [get_bd_pins SPI_MASTER_TOP_0/clk]
connect_bd_net -net zynq_ultra_ps_e_0_pl_resetn0 [get_bd_pins ZYNQ_PS/pl_resetn0] [get_bd_pins SYSTEM_RESET/ext_reset_in]
connect_bd_net -net zynq_ultra_ps_e_0_pl_resetn1 [get_bd_pins ZYNQ_PS/pl_resetn1] [get_bd_pins IIC_RESET/ext_reset_in]
set_property PFM.AXI_PORT {M_AXI_HPM0_FPD {memport "M_AXI_GP" sptag "" memory "" is_range "false"} M_AXI_HPM1_FPD {memport "M_AXI_GP" sptag "" memory "" is_range "false"} S_AXI_HPC0_FPD {memport "S_AXI_HPC" sptag "HPC0" memory "" is_range "false"} S_AXI_HPC1_FPD {memport "S_AXI_HPC" sptag "HPC1" memory "" is_range "false"} S_AXI_HP0_FPD {memport "S_AXI_HP" sptag "HP0" memory "" is_range "false"} S_AXI_HP1_FPD {memport "S_AXI_HP" sptag "HP1" memory "" is_range "false"} S_AXI_HP2_FPD {memport "S_AXI_HP" sptag "HP2" memory "" is_range "false"} S_AXI_HP3_FPD {memport "S_AXI_HP" sptag "" memory "" is_range "false"} S_AXI_LPD {memport "MIG" sptag "" memory "" is_range "false"}} [get_bd_cells ZYNQ_PS]
set_property PFM.CLOCK {pl_clk0 {id "0" is_default "true" proc_sys_reset "/SYSTEM_RESET" status "fixed" freq_hz "149998505"} pl_clk1 {id "1" is_default "false" proc_sys_reset "/IIC_RESET" status "fixed" freq_hz "24999750"}} [get_bd_cells ZYNQ_PS]

# ---- address map ----
assign_bd_address -offset 0x0080000000 -range 4K -target_address_space [get_bd_addr_spaces ZYNQ_PS/Data] [get_bd_addr_segs CURRENT_MON_SPI/AXI_LITE/Reg]
assign_bd_address -offset 0x0080010000 -range 4K -target_address_space [get_bd_addr_spaces ZYNQ_PS/Data] [get_bd_addr_segs I2C_MASTER/S_AXI/Reg]
assign_bd_address -offset 0x0080020000 -range 4K -target_address_space [get_bd_addr_spaces ZYNQ_PS/Data] [get_bd_addr_segs INTERRUPTS/S_AXI/Reg]
assign_bd_address -offset 0x0080030000 -range 1K -target_address_space [get_bd_addr_spaces ZYNQ_PS/Data] [get_bd_addr_segs SPI_MASTER_TOP_0/AFE12_AXI/reg0]
assign_bd_address -offset 0x0080030400 -range 1K -target_address_space [get_bd_addr_spaces ZYNQ_PS/Data] [get_bd_addr_segs SPI_MASTER_TOP_0/AFE0_AXI/reg0]
assign_bd_address -offset 0x0080030800 -range 1K -target_address_space [get_bd_addr_spaces ZYNQ_PS/Data] [get_bd_addr_segs SPI_MASTER_TOP_0/AFE34_AXI/reg0]
assign_bd_address -offset 0x0080040000 -range 4K -target_address_space [get_bd_addr_spaces ZYNQ_PS/Data] [get_bd_addr_segs AFE_PD_RST/S_AXI/Reg]
assign_bd_address -offset 0x0080050000 -range 2K -target_address_space [get_bd_addr_spaces ZYNQ_PS/Data] [get_bd_addr_segs MUXA/S_AXI/Reg]
assign_bd_address -offset 0x0080060000 -range 2K -target_address_space [get_bd_addr_spaces ZYNQ_PS/Data] [get_bd_addr_segs MUX_EN/S_AXI/Reg]
assign_bd_address -offset 0x0090000000 -range 512K -target_address_space [get_bd_addr_spaces ZYNQ_PS/Data] [get_bd_addr_segs DAPHNE3_0/FE_AXI/reg0]
assign_bd_address -offset 0x0094000000 -range 512K -target_address_space [get_bd_addr_spaces ZYNQ_PS/Data] [get_bd_addr_segs DAPHNE3_0/SB_AXI/reg0]
assign_bd_address -offset 0x0098000000 -range 512K -target_address_space [get_bd_addr_spaces ZYNQ_PS/Data] [get_bd_addr_segs DAPHNE3_0/EP_AXI/reg0]

validate_bd_design
save_bd_design
